# Altium schematic sheet PowerCircuit.SchDoc
size A
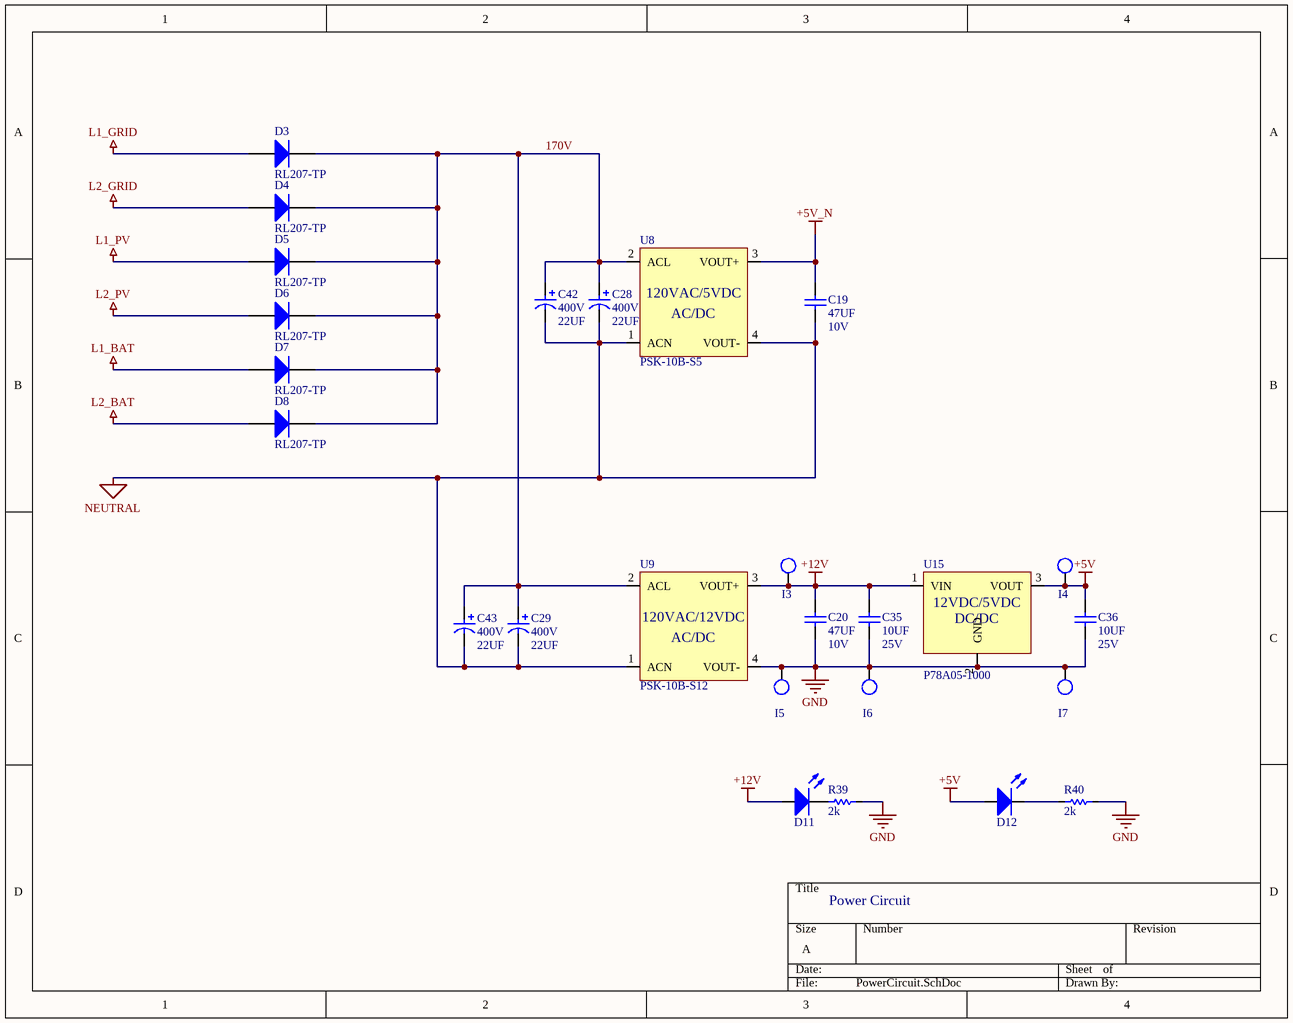
[diagram p0: PowerCircuit.SchDoc]

## Parts
C19  Capacitance: 47UF  Voltage - Rated: 10V  [CAPC3216X16N]  (hidden comment: GRM31CR61A476ME15L)
C20  Capacitance: 47UF  Voltage - Rated: 10V  [CAPC3216X16N]  (hidden comment: GRM31CR61A476ME15L)
C28  value 22UF  Voltage: 400V  [Radial-5mm]  (hidden comment: UCS2G220MHD)
C29  value 22UF  Voltage: 400V  [Radial-5mm]  (hidden comment: UCS2G220MHD)
C35  Capacitance: 10UF  Voltage - Rated: 25V  [CAPC3216X16N]  (hidden comment: GRM319R61E106KA12D)
C36  Capacitance: 10UF  Voltage - Rated: 25V  [CAPC3216X16N]  (hidden comment: GRM319R61E106KA12D)
C42  value 22UF  Voltage: 400V  [Radial-5mm]  (hidden comment: UCS2G220MHD)
C43  value 22UF  Voltage: 400V  [Radial-5mm]  (hidden comment: UCS2G220MHD)
D3  RL207-TP  [DO-204AL]
D4  RL207-TP  [DO-204AL]
D5  RL207-TP  [DO-204AL]
D6  RL207-TP  [DO-204AL]
D7  RL207-TP  [DO-204AL]
D8  RL207-TP  [DO-204AL]
D11  LTST-C190KGKT  [0603 LED]  (value not drawn)
D12  LTST-C190KGKT  [0603 LED]  (value not drawn)
I3  Testpoint  [Testpoint]  (value not drawn)
I4  Testpoint  [Testpoint]  (value not drawn)
I5  Testpoint  [Testpoint]  (value not drawn)
I6  Testpoint  [Testpoint]  (value not drawn)
I7  Testpoint  [Testpoint]  (value not drawn)
R39  Resistance: 2k  [RESC1608X06N]  (hidden comment: RC0603FR-072KL)
R40  Resistance: 2k  [RESC1608X06N]  (hidden comment: RC0603FR-072KL)
U8  PSK-10B-S5  [PSK-10B-S5]
U9  PSK-10B-S12  [PSK-10B-S5]
U15  P78A05-1000  [P78A05-1000]

## Nets
+5V: C36.2 D12.1(A) I4.1(TP) U15.3(VOUT)
+5V_N: C19.2 U8.3(VOUT+)
+12V: C20.2 C35.2 D11.1(A) I3.1(TP) U9.3(VOUT+) U15.1(VIN)
GND: C20.1 C35.1 C36.1 I5.1(TP) I6.1(TP) I7.1(TP) R39.2 R40.2 U9.4(VOUT-) U15.2(GND)
L1_BAT: D7.1(A)
L1_GRID: D3.1(A)
L1_PV: D5.1(A)
L2_BAT: D8.1(A)
L2_GRID: D4.1(A)
L2_PV: D6.1(A)
NEUTRAL: C19.1 C28.2 C29.2 C42.2 C43.2 U8.1(ACN) U8.4(VOUT-) U9.1(ACN)
170V: C28.1 C29.1 C42.1 C43.1 D3.2(K) D4.2(K) D5.2(K) D6.2(K) D7.2(K) D8.2(K) U8.2(ACL) U9.2(ACL)
NetD11_2: D11.2(K) R39.1
NetD12_2: D12.2(K) R40.1

## Notes on the sheet
- Power Circuit
- (in symbol P78A05-1000) 12VDC/5VDC; DC/DC
- (in symbol PSK-10B-S5) 120VAC/5VDC; AC/DC
- (in symbol PSK-10B-S12) 120VAC/12VDC; AC/DC

## Library data of the parts
C19 C20 = GRM31CR61A476ME15L: CAP CER 47UF 10V X5R 1206; Manufacturer: Murata Electronics North America; Manufacturer Part Number: GRM31CR61A476ME15L; Supplier 1: Digi-Key; Supplier Part Number 1: 490-5528-1-ND
C28 C29 C42 C43 = UCS2G220MHD: CAP ALUM 22UF 20% 400V RADIAL; Manufacturer: Nichicon; Manufacturer Part Number: UCS2G220MHD; Supplier 1: Digi-Key; Supplier Part Number 1: 493-5875-ND
C35 C36 = GRM319R61E106KA12D: CAP CER 10UF 25V X5R 1206; Manufacturer: Murata Electronics North America; Manufacturer Part Number: GRM319R61E106KA12D; Supplier 1: Digi-Key; Supplier Part Number 1: 490-5525-1-ND
D3-D8 = RL207-TP: DIODE GEN PURP 1KV 2A DO15; Manufacturer: Micro Commercial Co.; Voltage - Forward (Vf) (Max) @ If: 1V @ 2A; Voltage - DC Reverse (Vr) (Max): 1000V; Manufacturer Part Number: RL207-TP; Supplier 1: Digi-Key; Supplier Part Number 1: RL207-TPCT-ND; Current - Average Rectified (Io): 2A
D11 D12 = LTST-C190KGKT: LED GREEN CLEAR 0603 SMD; Manufacturer: Lite-On Inc.; Manufacturer Part Number: LTST-C190KGKT; Supplier 1: Digi-Key; Supplier Part Number 1: 160-1435-1-ND
R39 R40 = RC0603FR-072KL: RES SMD 2K OHM 1% 1/10W 0603; Manufacturer: Yageo; Manufacturer Part Number: RC0603FR-072KL; Supplier 1: Digi-Key; Supplier Part Number 1: 311-2.00KHRCT-ND
U8 = PSK-10B-S5: AC/DC CONVERTER 120V-5V 10W; Manufacturer: CUI Inc.; Supplier 1: Digi-Key; Supplier Part Number 1: 102-4152-ND; Manufacturer Part Number: PSK-10B-S5
U9 = PSK-10B-S12: AC/DC CONVERTER 120V-12V 10W; Manufacturer: CUI Inc.; Supplier 1: Digi-Key; Supplier Part Number 1: 102-4153-ND; Manufacturer Part Number: PSK-10B-S12
U15 = P78A05-1000: DC/DC CONVERTER 5V 5W; Manufacturer: CUI Inc.; Supplier 1: Digi-Key; Supplier Part Number 1: 102-3781-ND; Manufacturer Part Number: P78A05-1000